# EAGLE schematic simcovox_atmega (EAGLE 7.5.0)
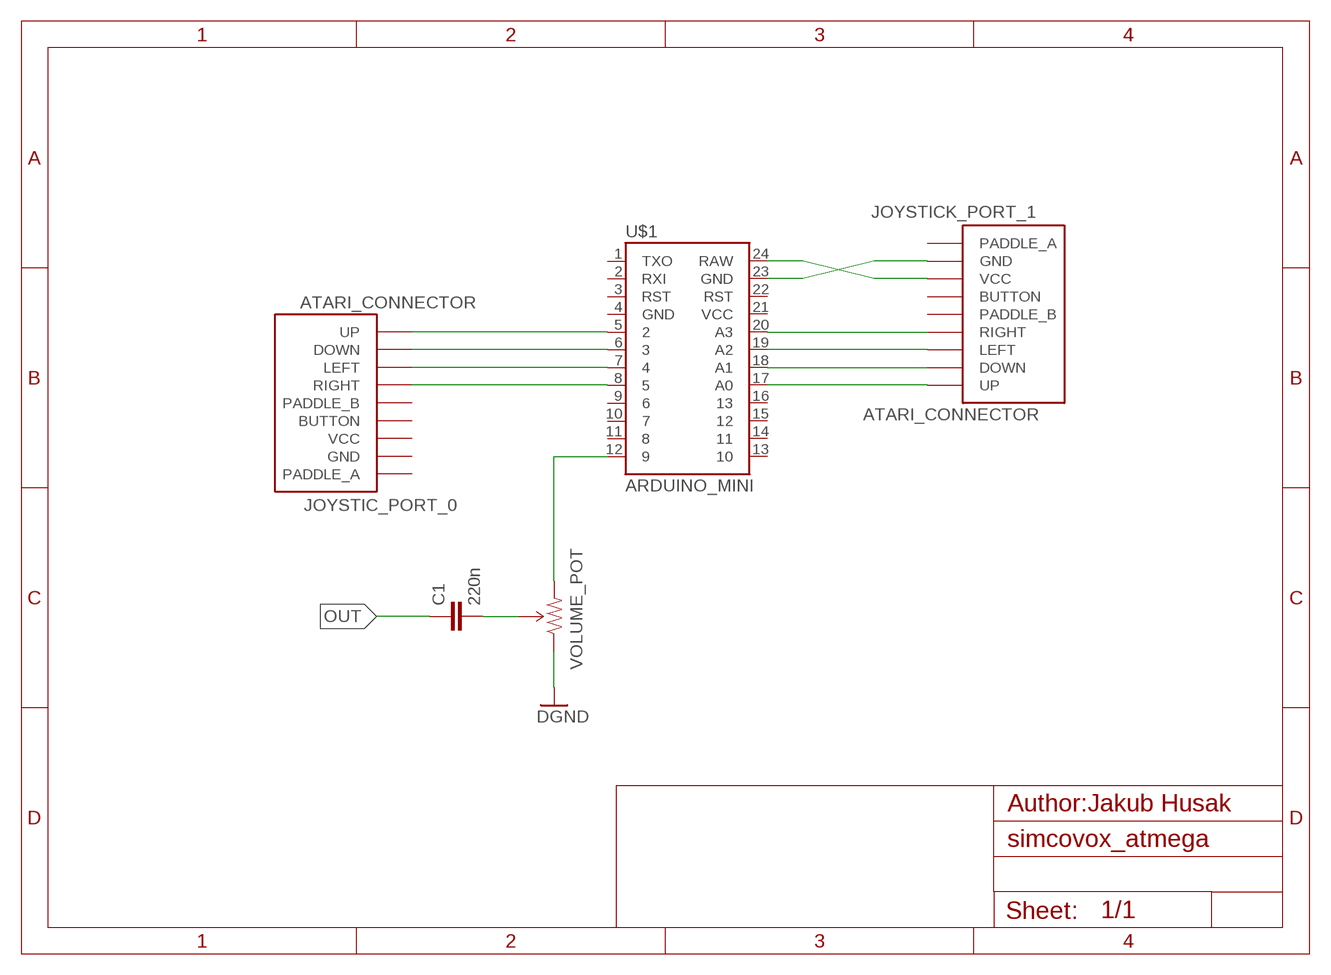
[diagram p0: schematic, sheet 1]

## Parts
C1  220n  CAPKIT  [CAP-PTH-SMALL-KIT]
JOYSTIC_PORT_0  ATARI_CONNECTOR  [ATARI_CONNECTOR]
JOYSTICK_PORT_1  ATARI_CONNECTOR  [ATARI_CONNECTOR]
U$1  ARDUINO_MINI  [ARDUINO_MINI]
VOLUME_POT  TRIMPOTPTH  [TRIM_POT_PTH]

## Nets
GND: VOLUME_POT.1(CCW) ; supply symbol labelled DGND
N$1: C1.2 VOLUME_POT.2(WIPER)
N$2: U$1.12 VOLUME_POT.3(CW)
N$3: JOYSTIC_PORT_0.P$5(UP) U$1.5
N$4: JOYSTIC_PORT_0.P$6(DOWN) U$1.6
N$5: JOYSTIC_PORT_0.P$7(LEFT) U$1.7
N$6: JOYSTIC_PORT_0.P$8(RIGHT) U$1.8
N$7: JOYSTICK_PORT_1.P$8(RIGHT) U$1.20(A3)
N$8: JOYSTICK_PORT_1.P$7(LEFT) U$1.19(A2)
N$9: JOYSTICK_PORT_1.P$6(DOWN) U$1.18(A1)
N$10: JOYSTICK_PORT_1.P$5(UP) U$1.17(A0)
N$11: JOYSTICK_PORT_1.P$2(VCC) U$1.24(RAW)
N$12: JOYSTICK_PORT_1.P$3(GND) U$1.23(GND)
OUT: C1.1
Unconnected: JOYSTIC_PORT_0.P$1(BUTTON) JOYSTIC_PORT_0.P$2(VCC) JOYSTIC_PORT_0.P$3(GND) JOYSTIC_PORT_0.P$4(PADDLE_A) JOYSTIC_PORT_0.P$9(PADDLE_B) JOYSTICK_PORT_1.P$1(BUTTON) JOYSTICK_PORT_1.P$4(PADDLE_A) JOYSTICK_PORT_1.P$9(PADDLE_B) U$1.1(TXO) U$1.2(RXI) U$1.3(RST) U$1.4(GND) U$1.9 U$1.10 U$1.11 U$1.13 U$1.14 U$1.15 U$1.16 U$1.21(VCC) U$1.22(RST)

## Notes on the sheet
- Author:Jakub Husak

## Library data of the parts
C1 = SparkFun-Capacitors:CAP: Capacitor Standard 0603 ceramic capacitor, and 0.1" leaded capacitor.
JOYSTIC_PORT_0 JOYSTICK_PORT_1 = SparkFun-Connectors:ATARI_CONNECTOR: DB9 labeled for Atari joystick
U$1 = SparkFun-Boards:ARDUINO_MINI: Arduino Pro Mini footprint
VOLUME_POT = SparkFun-Electromechanical:TRIMPOT: Various small potentiometers for "set-and-forget" applications